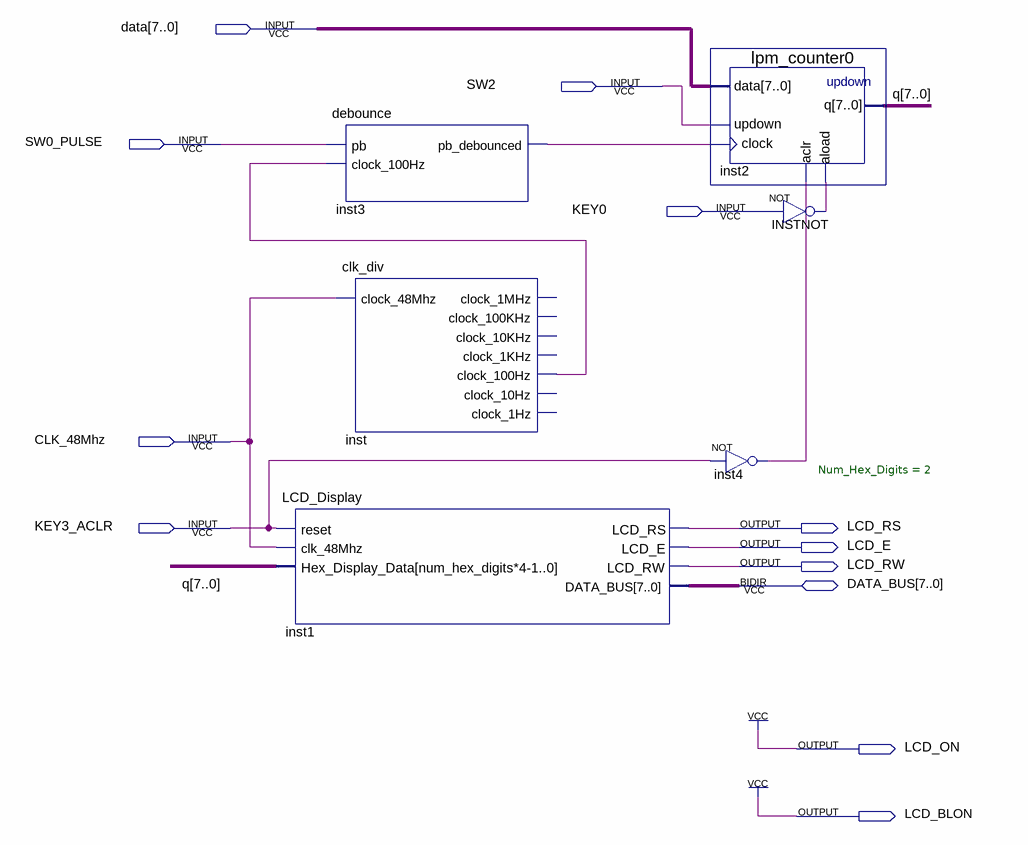
[diagram p0: schematic sheet]
// Quartus schematic tutor3.bdf as structural Verilog: 6 symbols, 12 pins
module tutor3 (
  input  [7:0] data,
  input  SW2,
  input  SW0_PULSE,
  input  KEY0,
  input  CLK_48Mhz,
  input  KEY3_ACLR,
  inout  [7:0] DATA_BUS,
  output LCD_RS,
  output LCD_E,
  output LCD_RW,
  output LCD_ON,
  output LCD_BLON
);

  wire inst3_pb_debounced, inst4_out, inst_clock_100hz, INSTNOT_out;
  wire [7:0] q;

  debounce inst3 (.pb(SW0_PULSE), .clock_100Hz(inst_clock_100hz), .pb_debounced(inst3_pb_debounced));
  clk_div inst (
    .clock_48Mhz(CLK_48Mhz), .clock_100Hz(inst_clock_100hz));  // open: clock_1MHz, clock_100KHz, clock_10KHz, clock_1KHz, clock_10Hz, clock_1Hz
  LCD_Display #(.Num_Hex_Digits(2)) inst1 (
    .reset(KEY3_ACLR), .clk_48Mhz(CLK_48Mhz), .Hex_Display_Data(q), .LCD_RS(LCD_RS), .LCD_E(LCD_E),
    .LCD_RW(LCD_RW), .DATA_BUS(DATA_BUS));
  lpm_counter0 inst2 (
    .data(data), .updown(SW2), .clock(inst3_pb_debounced), .aclr(inst4_out), .aload(INSTNOT_out), .q(q));
  not inst4 (inst4_out, KEY3_ACLR);
  not INSTNOT (INSTNOT_out, KEY0);

  assign LCD_BLON = 1'b1;
  assign LCD_ON = 1'b1;
endmodule
